# Altium schematic sheet 04_Audio.SchDoc
size A4; SheetNumber: 4; SheetTotal: 6
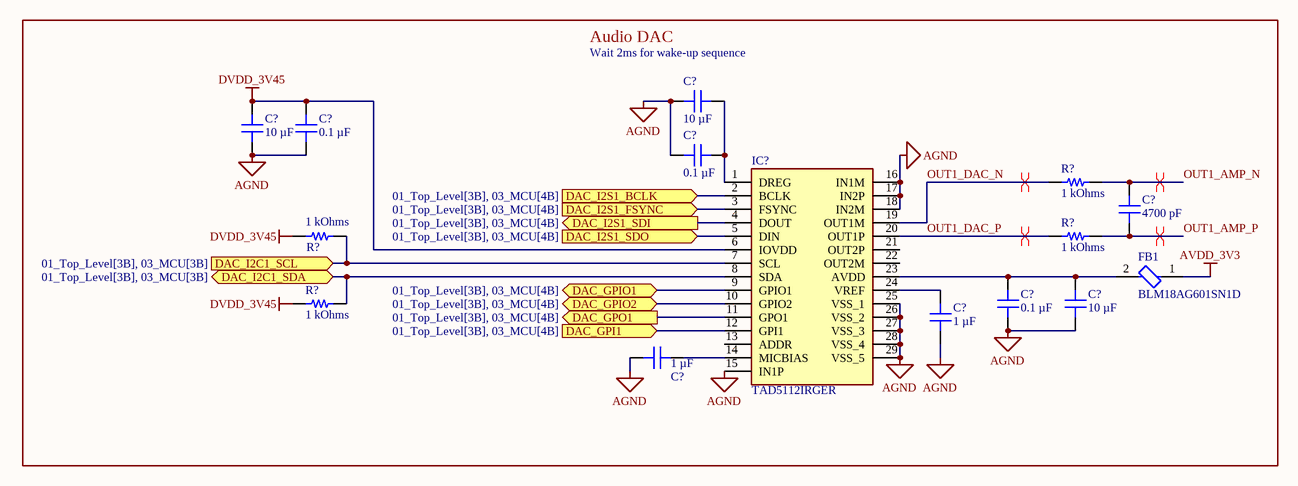
[diagram p0: 04_Audio.SchDoc]

## Parts
(Parts that share a designator on the sheet are numbered #1, #2 ... from top to bottom, then left to right.)
C?#1  10 µF  [CAP 0805_2012]
C?#2  10 µF  [CAP 0805_2012]
C?#3  0.1 µF  [CAP 0402_1005]
C?#4  0.1 µF  [CAP 0402_1005]
C?#5  4700 pF  [CAP 0402_1005]
C?#6  0.1 µF  [CAP 0402_1005]
C?#7  10 µF  [CAP 0805_2012]
C?#8  1 µF  [CAP 0603_1608]
C?#9  1 µF  [CAP 0603_1608]
FB1  BLM18AG601SN1D  [FP-BLM18-0_15-t0_8-MFG]
IC?  TAD5112IRGER  [TAD5112IRGER]
R?#1  1 kOhms  [RES 0402_1005]
R?#2  1 kOhms  [RES 0402_1005]
R?#3  1 kOhms  [RES 0402_1005]
R?#4  1 kOhms  [RES 0402_1005]

## Ports
DAC_GPI1 (in, see 01_Top_Level[3B], 03_MCU[4B]), DAC_GPIO1 (bidir, see 01_Top_Level[3B], 03_MCU[4B]), DAC_GPIO2 (bidir, see 01_Top_Level[3B], 03_MCU[4B]), DAC_GPO1 (out, see 01_Top_Level[3B], 03_MCU[4B]), DAC_I2C1_SCL (in, see 01_Top_Level[3B], 03_MCU[3B]), DAC_I2C1_SDA (bidir, see 01_Top_Level[3B], 03_MCU[3B]), DAC_I2S1_BCLK (in, see 01_Top_Level[3B], 03_MCU[4B]), DAC_I2S1_FSYNC (in, see 01_Top_Level[3B], 03_MCU[4B]), DAC_I2S1_SDI (out, see 01_Top_Level[3B], 03_MCU[4B]), DAC_I2S1_SDO (in, see 01_Top_Level[3B], 03_MCU[4B])

## Nets
AGND: C?#1.2 C?#2.2 C?#3.1 C?#4.1 C?#6.1 C?#7.2 C?#8.1 C?#9.2 IC?.15(IN1P) IC?.16(IN1M) IC?.17(IN2P) IC?.18(IN2M) IC?.25(VSS_1) IC?.26(VSS_2) IC?.27(VSS_3) IC?.28(VSS_4) IC?.29(VSS_5)
AVDD_3V3: FB1.1
DVDD_3V45: C?#2.1 C?#3.2 IC?.6(IOVDD) R?#2.2 R?#4.2
DAC_GPI1: IC?.12(GPI1) ; port DAC_GPI1
DAC_GPIO1: IC?.9(GPIO1) ; port DAC_GPIO1
DAC_GPIO2: IC?.10(GPIO2) ; port DAC_GPIO2
DAC_GPO1: IC?.11(GPO1) ; port DAC_GPO1
DAC_I2C1_SCL: IC?.7(SCL) R?#2.1 ; port DAC_I2C1_SCL
DAC_I2C1_SDA: IC?.8(SDA) R?#4.1 ; port DAC_I2C1_SDA
DAC_I2S1_BCLK: IC?.2(BCLK) ; port DAC_I2S1_BCLK
DAC_I2S1_FSYNC: IC?.3(FSYNC) ; port DAC_I2S1_FSYNC
DAC_I2S1_SDI: IC?.4(DOUT) ; port DAC_I2S1_SDI
DAC_I2S1_SDO: IC?.5(DIN) ; port DAC_I2S1_SDO
OUT1_AMP_N: C?#5.2 R?#1.2
OUT1_AMP_P: C?#5.1 R?#3.2
OUT1_DAC_N: IC?.19(OUT1M) R?#1.1
OUT1_DAC_P: IC?.20(OUT1P) R?#3.1
NetC?#1_1: C?#1.1 C?#4.2 IC?.1(DREG)
NetC?#6_2: C?#6.2 C?#7.1 FB1.2 IC?.23(AVDD)
NetC?#8_2: C?#8.2 IC?.24(VREF)
NetC?#9_1: C?#9.1 IC?.14(MICBIAS)

Not connected (* = marked no-connect by the designer): IC? 13(ADDR) 21(OUT2P) 22(OUT2M)

## Layout directives
differential pair: OUT1_AMP_N, OUT1_AMP_P, OUT1_DAC_N, OUT1_DAC_P

## Notes on the sheet
- Audio DAC
- (near C?#1) Wait 2ms for wake-up sequence

## Library data of the parts
C?#1 C?#2 C?#7 = CL21A106KOQNNNG: CAP CER 10UF 16V X5R 0805; manufacturer: Samsung Electro-Mechanics; Tolerance: ±10%; Part Number: CL21A106KOQNNNG; Capacitance: 10 µF; Applications: General Purpose; componentlink1description: Datasheet; componentlink1url: http://www.samsungsem.com/kr/support/product-search/mlcc/CL21A106KOQNNNG.jsp; componentlink2description: DigiKey Link; componentlink2url: https://www.digikey.com/en/products/detail/samsung-electro-mechanics/CL21A106KOQNNNG/3894417; Device Package: 0805 (2012 Metric); lastupdated: 4/6/2026 7:33:06 PM; Lifecycle Status: Active; Minimum Order: 1; Mounting Type: Surface Mount, MLCC; Operating Temperature: -55°C ~ 85°C; Package / Case: 0805 (2012 Metric); packaging: TapeAndReel; partid: 39874; Part Status: Active; price: 0.01; series: CL; Size / Dimension: 0.079" L x 0.049" W (2.00mm x 1.25mm); Supplier 1: DigiKey; Supplier Part Number 1: 1276-6455-1-ND; Temperature Coefficient: X5R; Thickness (Max): 0.055" (1.40mm); value: 10 µF; Voltage - Rated: 16V
C?#3 C?#4 C?#6 = EMF105B7104KVHF: CAP CER 0.1UF 16V X7R 0402; manufacturer: Taiyo Yuden; Tolerance: ±10%; Part Number: EMF105B7104KVHF; Capacitance: 0.1 µF; Applications: Automotive, SMPS Filtering; componentlink1description: Datasheet; componentlink1url: https://ds.yuden.co.jp/TYCOMPAS/ut/detail?pn=EMF105B7104KVHF&u=M; componentlink2description: DigiKey Link; componentlink2url: https://www.digikey.com/en/products/detail/taiyo-yuden/EMF105B7104KVHF/10379129; Device Package: 0402 (1005 Metric); lastupdated: 4/6/2026 7:11:11 PM; Lifecycle Status: Active; Minimum Order: 1; Mounting Type: Surface Mount, MLCC; Operating Temperature: -55°C ~ 125°C; Package / Case: 0402 (1005 Metric); packaging: TapeAndReel; partid: 1868; Part Status: Active; price: 0.01; Ratings: AEC-Q200; series: M; Size / Dimension: 0.039" L x 0.020" W (1.00mm x 0.50mm); Supplier 1: DigiKey; Supplier Part Number 1: 587-6563-1-ND; Temperature Coefficient: X7R; Thickness (Max): 0.022" (0.55mm); value: 0.1 µF; Voltage - Rated: 16V
C?#5 = 885012205029: CAP CER 4700PF 16V X7R 0402; manufacturer: Würth Elektronik; Tolerance: ±10%; Part Number: 885012205029; Capacitance: 4700 pF; Applications: General Purpose; componentlink1description: Datasheet; componentlink1url: https://katalog.we-online.de/pbs/datasheet/885012205029.pdf; componentlink2description: DigiKey Link; componentlink2url: https://www.digikey.com/en/products/detail/würth-elektronik/885012205029/5453379; Device Package: 0402 (1005 Metric); lastupdated: 4/6/2026 7:11:09 PM; Lifecycle Status: Active; Minimum Order: 1; Mounting Type: Surface Mount, MLCC; Operating Temperature: -55°C ~ 125°C; Package / Case: 0402 (1005 Metric); packaging: TapeAndReel; partid: 2028; Part Status: Active; price: 0.01; series: WCAP-CSGP; Size / Dimension: 0.039" L x 0.020" W (1.00mm x 0.50mm); Supplier 1: DigiKey; Supplier Part Number 1: 732-7524-1-ND; Temperature Coefficient: X7R; Thickness (Max): 0.022" (0.55mm); value: 4700 pF; Voltage - Rated: 16V
C?#8 C?#9 = CL10A105KA8NFNC: CAP CER 1UF 25V X5R 0603; manufacturer: Samsung Electro-Mechanics; Tolerance: ±10%; Part Number: CL10A105KA8NFNC; Capacitance: 1 µF; Applications: General Purpose; componentlink1description: Datasheet; componentlink1url: http://www.samsungsem.com/kr/support/product-search/mlcc/CL10A105KA8NFNC.jsp; componentlink2description: DigiKey Link; componentlink2url: https://www.digikey.com/en/products/detail/samsung-electro-mechanics/CL10A105KA8NFNC/3887517; Device Package: 0603 (1608 Metric); lastupdated: 4/6/2026 7:23:08 PM; Lifecycle Status: Active; Minimum Order: 1; Mounting Type: Surface Mount, MLCC; Operating Temperature: -55°C ~ 85°C; Package / Case: 0603 (1608 Metric); packaging: TapeAndReel; partid: 14268; Part Status: Active; price: 0.01; series: CL; Size / Dimension: 0.063" L x 0.031" W (1.60mm x 0.80mm); Supplier 1: DigiKey; Supplier Part Number 1: 1276-1859-1-ND; Temperature Coefficient: X5R; Thickness (Max): 0.035" (0.90mm); value: 1 µF; Voltage - Rated: 25V
FB1 = CMP-0686-00436-3: Chip Ferrite Bead, 0603, 600Ω @ 100MHz, 0.38Ω, 25%, 500mA; Number of Lines: 1; Impedance: 600R; DC Resistance (DCR): 380mR; Material: Steel; Shielding: Unshielded; Max DC Current: 500mA; Termination: SMD/SMT; Military Standard: Not; Number of Circuits: 1; Min Operating Temperature: -55°C; Case Code (Imperial): 0603; Width: 0.8mm; Current Rating: 500mA; Lead Free: Lead Free; Packaging: Tape and Reel; Frequency: 100MHz; Max Operating Temperature: 125°C; DC Current: 500mA; REACH SVHC: No SVHC; Case/Package: 0603; Package Quantity: 1; Height: 0.8mm; Number of Pins: 2; Depth: 0.8mm; Test Frequency: 100MHz; Case Code (Metric): 1608; Tolerance: 25%; Core Material: Ferrite; Weight: 7.1E-05oz; Max Current Rating: 500mA; Radiation Hardening: No; Length: 1.6mm; RoHS Compliant: Yes
IC? = TAD5112IRGER: Integrated Circuit; Manufacturer_Name: Texas Instruments; Datasheet Link: https://www.ti.com/lit/gpn/tad5112; Height: 1mm; Manufacturer_Part_Number: TAD5112IRGER; DigiKey Link: https://www.digikey.ca/en/products/detail/texas-instruments/TAD5112IRGER/26251062
R?#1-R?#4 = RC0402FR-071KL: RES 1K OHM 1% 1/16W 0402; Manufacturer: Yageo; Power (Watts): 0.063W, 1/16W; Temperature Coefficient: ±100ppm/°C; Part Number: RC0402FR-071KL; Value: 1 kOhms; ComponentLink1Description: Datasheet; ComponentLink1URL: https://www.yageo.com/upload/media/product/productsearch/datasheet/rchip/PYu-RC_Group_51_RoHS_L_10.pdf; ComponentLink2Description: DigiKey Link; ComponentLink2URL: https://www.digikey.com/en/products/detail/yageo/RC0402FR-071KL/726513; Composition: Thick Film; Device Package: 0402 (1005 Metric); Features: Moisture Resistant; Height - Seated (Max): 0.016" (0.40mm); LastUpdated: 4/6/2026 7:41:07 PM; Lifecycle Status: Active; Minimum Order: 1; Number of Terminations: 2; Operating Temperature: -55°C ~ 155°C; Package / Case: 0402 (1005 Metric); Packaging: CutTape; PartId: 17596; Part Status: Active; Price: 0.01; Resistance: 1 kOhms; Series: RC_L; Size / Dimension: 0.039" L x 0.020" W (1.00mm x 0.50mm); Supplier 1: DigiKey; Supplier Part Number 1: 311-1.00KLRCT-ND; Supplier Device Package: 0402; Tolerance: ±1%